# Altium schematic sheet Generator_main.SchDoc: Differential Signal Generator - Connectors
size A4; Author: Philippe Groulx-Létourneau; DrawnBy: Philippe Groulx-Létourneau; SheetNumber: 1; SheetTotal: 4
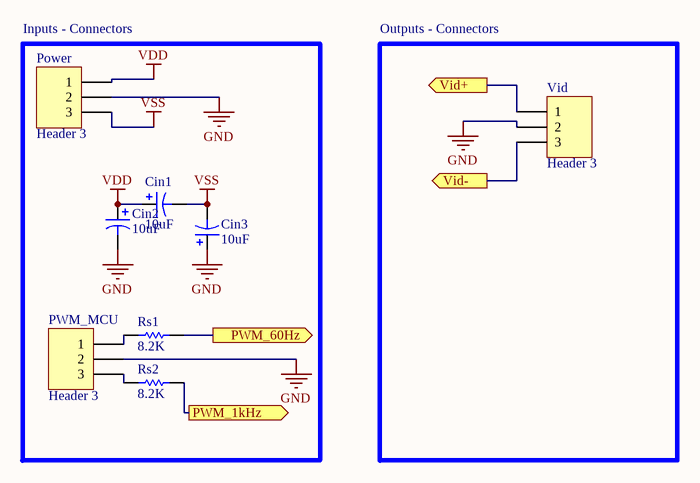
[diagram p0: Generator_main.SchDoc]

## Parts
Cin1  value 10uF  [RB7.6-15]  (hidden comment: Cap Pol1)
Cin2  value 10uF  [RB7.6-15]  (hidden comment: Cap Pol1)
Cin3  value 10uF  [RB7.6-15]  (hidden comment: Cap Pol1)
Power  Header 3  [MTA_3M]
PWM_MCU  Header 3  [MTA_3M]
Rs1  value 8.2K  [Resistor_Axial 0.4]  (hidden comment: Res1)
Rs2  value 8.2K  [Resistor_Axial 0.4]  (hidden comment: Res1)
Vid  Header 3  [MTA_3M]

## Blocks framed on the sheet
Inputs - Connectors: Cin1-Cin3 Power PWM_MCU Rs1 Rs2
Outputs - Connectors: Vid

## Ports
PWM_1kHz (out, see Filtre_PWM1kHz[1B]), PWM_60Hz (out, see Filtre_PWM60Hz[1C]), Vid+ (out, see Differential_Noise_Generator[3A]), Vid- (out, see Differential_Noise_Generator[3B])

## Nets
GND: Cin2.2 Cin3.1 Power.2 PWM_MCU.2 Vid.2
VDD: Cin1.1 Cin2.1 Power.1
VSS: Cin1.2 Cin3.2 Power.3
PWM_1kHz: Rs2.2 ; port PWM_1kHz
PWM_60Hz: Rs1.2 ; port PWM_60Hz
Vid+: Vid.1 ; port Vid+
Vid-: Vid.3 ; port Vid-
NetPWM_MCU_1: PWM_MCU.1 Rs1.1
NetPWM_MCU_3: PWM_MCU.3 Rs2.1

## Library data of the parts
Cin1-Cin3 = Cap Pol1: Polarized Capacitor (Radial); Published: 8-Jun-2000; LatestRevisionDate: 17-Jul-2002; LatestRevisionNote: Re-released for DXP Platform.; PackageReference: RB7.6-15; Publisher: Altium Limited; PackageDescription: Polarized Capacitor (Radial); 2 Leads
Power PWM_MCU Vid = Header 3: Header, 3-Pin; LatestRevisionDate: 17-Jul-2002; LatestRevisionNote: Re-released for DXP Platform.; Publisher: Altium Limited
Rs1 Rs2 = Res1: Resistor; Published: 8-Jun-2000; LatestRevisionDate: 17-Jul-2002; LatestRevisionNote: Re-released for DXP Platform.; PackageReference: AXIAL-0.3; Publisher: Altium Limited; PackageDescription: Axial Device, Thru-Hole; 2 Leads; 0.3 in Pin Spacing